# Altium project AT90PWM_PCB.PrjPcb
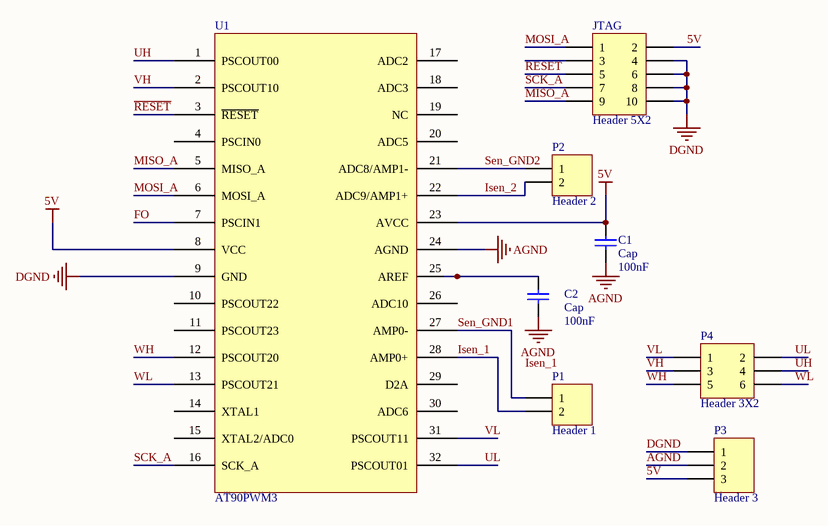
[diagram p0: AT90PWM_PCB.SchDoc]
1 sheet, 8 parts. Net scope: global (net labels, ports and power ports of the same name join across sheets).
Board file: AT90PWM_PCB.PcbDoc

## Sheet AT90PWM_PCB.SchDoc
size A4

### Parts
C1  Cap  value 100nF  [NPolar_Cap]
C2  Cap  value 100nF  [NPolar_Cap]
JTAG  Header 5X2  [HDR2X5]
P1  Header 1  [HDR1X2]
P2  Header 2  [HDR1X2]
P3  Header 3  [HDR1X3]
P4  Header 3X2  [HDR2X3]
U1  AT90PWM3  [AT90PWM3B]

### Nets
5V: C1.2 JTAG.2 P3.3 U1.8(VCC) U1.23(AVCC)
AGND: C1.1 C2.1 P3.2 U1.24(AGND)
DGND: JTAG.4 JTAG.6 JTAG.8 JTAG.10 P3.1 U1.9(GND)
~{RESET}: JTAG.5 U1.3(~{RESET})
FO: U1.7(PSCIN1)
Isen_1: P1.2 U1.28(AMP0+)
Isen_2: P2.2 U1.22(ADC9/AMP1+)
MISO_A: JTAG.9 U1.5(MISO_A)
MOSI_A: JTAG.1 U1.6(MOSI_A)
SCK_A: JTAG.7 U1.16(SCK_A)
Sen_GND1: P1.1 U1.27(AMP0-)
Sen_GND2: P2.1 U1.21(ADC8/AMP1-)
UH: P4.4 U1.1(PSCOUT00)
UL: P4.2 U1.32(PSCOUT01)
VH: P4.3 U1.2(PSCOUT10)
VL: P4.1 U1.31(PSCOUT11)
WH: P4.5 U1.12(PSCOUT20)
WL: P4.6 U1.13(PSCOUT21)
NetC2_2: C2.2 U1.25(AREF)

Not connected (* = marked no-connect by the designer): JTAG 3; U1 4(PSCIN0) 10(PSCOUT22) 11(PSCOUT23) 14(XTAL1) 15(XTAL2/ADC0) 17(ADC2) 18(ADC3) 19(NC) 20(ADC5) 26(ADC10) 29(D2A) 30(ADC6)

### Notes on the sheet
- Labels drawn without touching a wire or pin: Isen_1

### Library data of the parts
C1 C2 = Cap: Capacitor; Published: 8-Jun-2000; LatestRevisionDate: 17-Jul-2002; LatestRevisionNote: Re-released for DXP Platform.; PackageReference: RAD-0.3; Publisher: Altium Limited
JTAG = Header 5X2: Header, 5-Pin, Dual row; LatestRevisionDate: 17-Jul-2002; LatestRevisionNote: Re-released for DXP Platform.; Publisher: Altium Limited
P1 P2 = Header 2: Header, 2-Pin; LatestRevisionDate: 17-Jul-2002; LatestRevisionNote: Re-released for DXP Platform.; Publisher: Altium Limited
P3 = Header 3: Header, 3-Pin; LatestRevisionDate: 17-Jul-2002; LatestRevisionNote: Re-released for DXP Platform.; Publisher: Altium Limited
P4 = Header 3X2: Header, 3-Pin, Dual row; LatestRevisionDate: 17-Jul-2002; LatestRevisionNote: Re-released for DXP Platform.; Publisher: Altium Limited